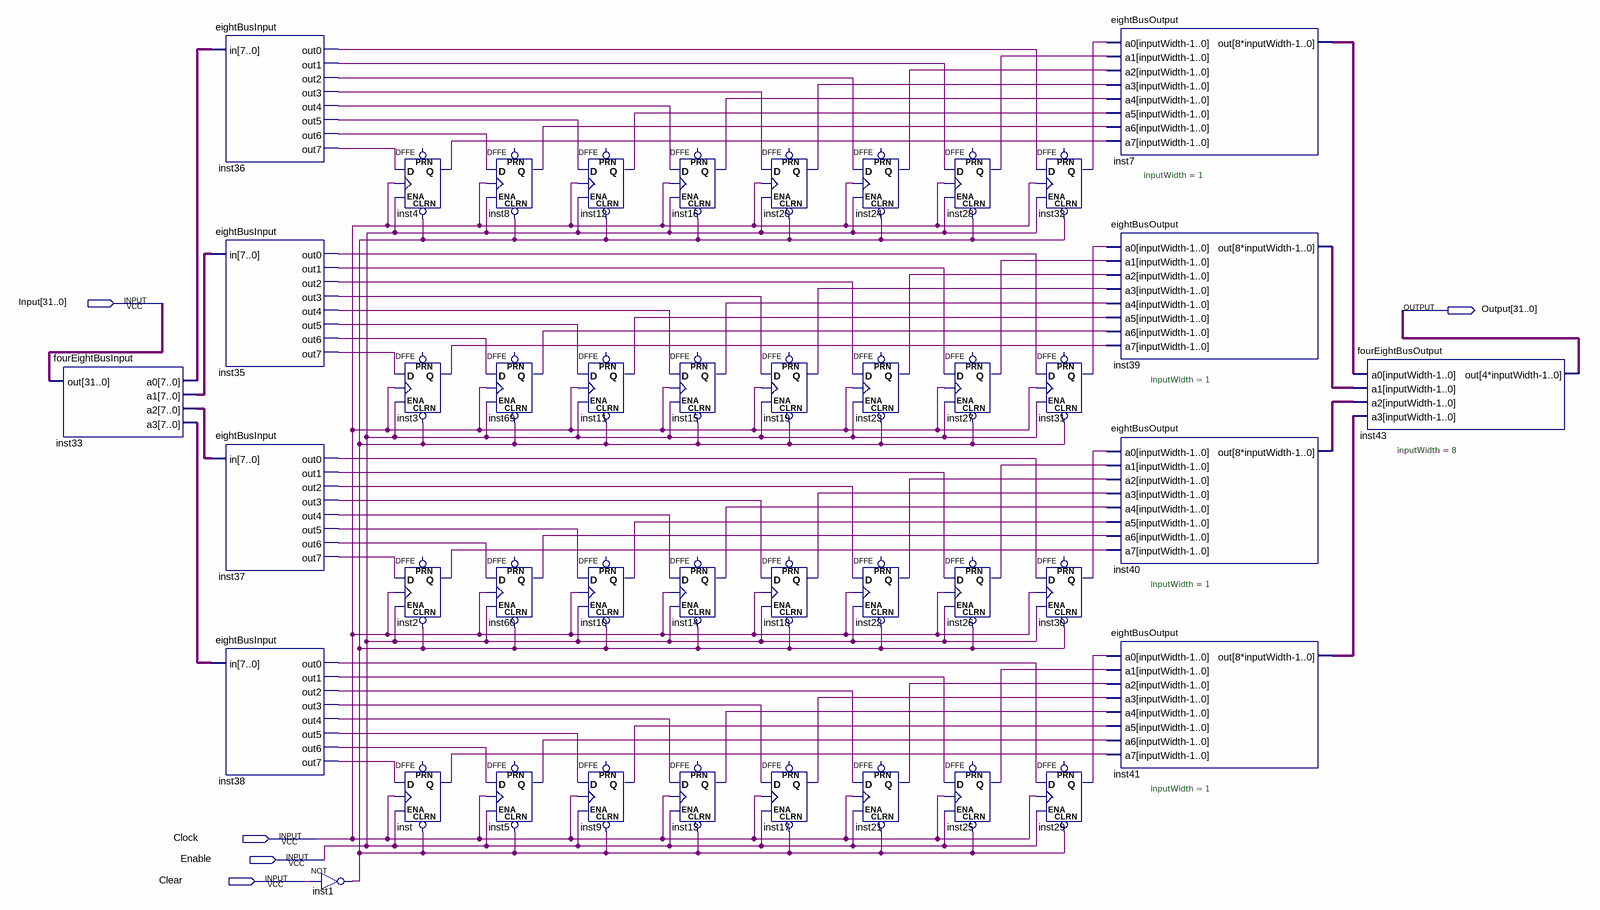
[diagram p0: schematic sheet]
// Quartus schematic ThirtyTwoBitRegister.bdf as structural Verilog: 43 symbols, 5 pins
module ThirtyTwoBitRegister (
  input  [31:0] Input,
  input  Clock,
  input  Enable,
  input  Clear,
  output [31:0] Output
);

  wire inst1_out, inst2_q, inst3_q, inst4_q, inst5_q, inst8_q, inst9_q, inst10_q, inst11_q, inst12_q,
       inst13_q, inst14_q, inst15_q, inst16_q, inst17_q, inst18_q, inst19_q, inst20_q, inst21_q, inst22_q,
       inst23_q, inst24_q, inst25_q, inst26_q, inst27_q, inst28_q, inst29_q, inst30_q, inst31_q, inst32_q,
       inst35_out0, inst35_out1, inst35_out2, inst35_out3, inst35_out4, inst35_out5, inst35_out6,
       inst35_out7, inst36_out0, inst36_out1, inst36_out2, inst36_out3, inst36_out4, inst36_out5,
       inst36_out6, inst36_out7, inst37_out0, inst37_out1, inst37_out2, inst37_out3, inst37_out4,
       inst37_out5, inst37_out6, inst37_out7, inst38_out0, inst38_out1, inst38_out2, inst38_out3,
       inst38_out4, inst38_out5, inst38_out6, inst38_out7, inst60_q, inst69_q, inst_q;
  wire [7:0] inst7_out, inst33_a0, inst33_a1, inst33_a2, inst33_a3, inst39_out, inst40_out, inst41_out;

  fourEightBusInput inst33 (.out(Input), .a0(inst33_a0), .a1(inst33_a1), .a2(inst33_a2), .a3(inst33_a3));
  eightBusInput inst36 (
    .in(inst33_a0), .out0(inst36_out0), .out1(inst36_out1), .out2(inst36_out2), .out3(inst36_out3),
    .out4(inst36_out4), .out5(inst36_out5), .out6(inst36_out6), .out7(inst36_out7));
  eightBusInput inst35 (
    .in(inst33_a1), .out0(inst35_out0), .out1(inst35_out1), .out2(inst35_out2), .out3(inst35_out3),
    .out4(inst35_out4), .out5(inst35_out5), .out6(inst35_out6), .out7(inst35_out7));
  eightBusInput inst37 (
    .in(inst33_a2), .out0(inst37_out0), .out1(inst37_out1), .out2(inst37_out2), .out3(inst37_out3),
    .out4(inst37_out4), .out5(inst37_out5), .out6(inst37_out6), .out7(inst37_out7));
  eightBusInput inst38 (
    .in(inst33_a3), .out0(inst38_out0), .out1(inst38_out1), .out2(inst38_out2), .out3(inst38_out3),
    .out4(inst38_out4), .out5(inst38_out5), .out6(inst38_out6), .out7(inst38_out7));
  not inst1 (inst1_out, Clear);
  DFFE inst4 (.CLRN(inst1_out), .D(inst36_out7), .CLK(Clock), .ENA(Enable), .Q(inst4_q));  // open: PRN
  DFFE inst3 (.CLRN(inst1_out), .D(inst35_out7), .CLK(Clock), .ENA(Enable), .Q(inst3_q));  // open: PRN
  DFFE inst2 (.CLRN(inst1_out), .D(inst37_out7), .CLK(Clock), .ENA(Enable), .Q(inst2_q));  // open: PRN
  DFFE inst (.CLRN(inst1_out), .D(inst38_out7), .CLK(Clock), .ENA(Enable), .Q(inst_q));  // open: PRN
  DFFE inst8 (.CLRN(inst1_out), .D(inst36_out6), .CLK(Clock), .ENA(Enable), .Q(inst8_q));  // open: PRN
  DFFE inst69 (.CLRN(inst1_out), .D(inst35_out6), .CLK(Clock), .ENA(Enable), .Q(inst69_q));  // open: PRN
  DFFE inst60 (.CLRN(inst1_out), .D(inst37_out6), .CLK(Clock), .ENA(Enable), .Q(inst60_q));  // open: PRN
  DFFE inst5 (.CLRN(inst1_out), .D(inst38_out6), .CLK(Clock), .ENA(Enable), .Q(inst5_q));  // open: PRN
  DFFE inst12 (.CLRN(inst1_out), .D(inst36_out5), .CLK(Clock), .ENA(Enable), .Q(inst12_q));  // open: PRN
  DFFE inst11 (.CLRN(inst1_out), .D(inst35_out5), .CLK(Clock), .ENA(Enable), .Q(inst11_q));  // open: PRN
  DFFE inst10 (.CLRN(inst1_out), .D(inst37_out5), .CLK(Clock), .ENA(Enable), .Q(inst10_q));  // open: PRN
  DFFE inst9 (.CLRN(inst1_out), .D(inst38_out5), .CLK(Clock), .ENA(Enable), .Q(inst9_q));  // open: PRN
  DFFE inst16 (.CLRN(inst1_out), .D(inst36_out4), .CLK(Clock), .ENA(Enable), .Q(inst16_q));  // open: PRN
  DFFE inst15 (.CLRN(inst1_out), .D(inst35_out4), .CLK(Clock), .ENA(Enable), .Q(inst15_q));  // open: PRN
  DFFE inst14 (.CLRN(inst1_out), .D(inst37_out4), .CLK(Clock), .ENA(Enable), .Q(inst14_q));  // open: PRN
  DFFE inst13 (.CLRN(inst1_out), .D(inst38_out4), .CLK(Clock), .ENA(Enable), .Q(inst13_q));  // open: PRN
  DFFE inst20 (.CLRN(inst1_out), .D(inst36_out3), .CLK(Clock), .ENA(Enable), .Q(inst20_q));  // open: PRN
  DFFE inst19 (.CLRN(inst1_out), .D(inst35_out3), .CLK(Clock), .ENA(Enable), .Q(inst19_q));  // open: PRN
  DFFE inst18 (.CLRN(inst1_out), .D(inst37_out3), .CLK(Clock), .ENA(Enable), .Q(inst18_q));  // open: PRN
  DFFE inst17 (.CLRN(inst1_out), .D(inst38_out3), .CLK(Clock), .ENA(Enable), .Q(inst17_q));  // open: PRN
  DFFE inst24 (.CLRN(inst1_out), .D(inst36_out2), .CLK(Clock), .ENA(Enable), .Q(inst24_q));  // open: PRN
  DFFE inst23 (.CLRN(inst1_out), .D(inst35_out2), .CLK(Clock), .ENA(Enable), .Q(inst23_q));  // open: PRN
  DFFE inst22 (.CLRN(inst1_out), .D(inst37_out2), .CLK(Clock), .ENA(Enable), .Q(inst22_q));  // open: PRN
  DFFE inst21 (.CLRN(inst1_out), .D(inst38_out2), .CLK(Clock), .ENA(Enable), .Q(inst21_q));  // open: PRN
  DFFE inst28 (.CLRN(inst1_out), .D(inst36_out1), .CLK(Clock), .ENA(Enable), .Q(inst28_q));  // open: PRN
  DFFE inst27 (.CLRN(inst1_out), .D(inst35_out1), .CLK(Clock), .ENA(Enable), .Q(inst27_q));  // open: PRN
  DFFE inst26 (.CLRN(inst1_out), .D(inst37_out1), .CLK(Clock), .ENA(Enable), .Q(inst26_q));  // open: PRN
  DFFE inst25 (.CLRN(inst1_out), .D(inst38_out1), .CLK(Clock), .ENA(Enable), .Q(inst25_q));  // open: PRN
  DFFE inst32 (.CLRN(inst1_out), .D(inst36_out0), .CLK(Clock), .ENA(Enable), .Q(inst32_q));  // open: PRN
  DFFE inst31 (.CLRN(inst1_out), .D(inst35_out0), .CLK(Clock), .ENA(Enable), .Q(inst31_q));  // open: PRN
  DFFE inst30 (.CLRN(inst1_out), .D(inst37_out0), .CLK(Clock), .ENA(Enable), .Q(inst30_q));  // open: PRN
  DFFE inst29 (.CLRN(inst1_out), .D(inst38_out0), .CLK(Clock), .ENA(Enable), .Q(inst29_q));  // open: PRN
  eightBusOutput #(.inputWidth(1)) inst7 (
    .a0(inst32_q), .a1(inst28_q), .a2(inst24_q), .a3(inst20_q), .a4(inst16_q), .a5(inst12_q), .a6(inst8_q),
    .a7(inst4_q), .out(inst7_out));
  eightBusOutput #(.inputWidth(1)) inst39 (
    .a0(inst31_q), .a1(inst27_q), .a2(inst23_q), .a3(inst19_q), .a4(inst15_q), .a5(inst11_q), .a6(inst69_q),
    .a7(inst3_q), .out(inst39_out));
  eightBusOutput #(.inputWidth(1)) inst40 (
    .a0(inst30_q), .a1(inst26_q), .a2(inst22_q), .a3(inst18_q), .a4(inst14_q), .a5(inst10_q), .a6(inst60_q),
    .a7(inst2_q), .out(inst40_out));
  eightBusOutput #(.inputWidth(1)) inst41 (
    .a0(inst29_q), .a1(inst25_q), .a2(inst21_q), .a3(inst17_q), .a4(inst13_q), .a5(inst9_q), .a6(inst5_q),
    .a7(inst_q), .out(inst41_out));
  fourEightBusOutput #(.inputWidth(8)) inst43 (
    .a0(inst7_out), .a1(inst39_out), .a2(inst40_out), .a3(inst41_out), .out(Output));
endmodule
